# Altium project PCB_Project.PrjPcb
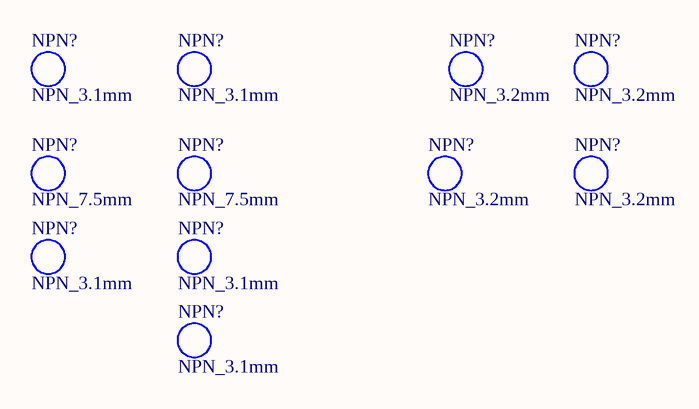
[diagram p0: snr-0005_panel.SchDoc]
1 sheet, 11 parts. Net scope: global (net labels, ports and power ports of the same name join across sheets).
Board file: snr-0007.PcbDoc

## Sheet snr-0005_panel.SchDoc
size A4; SheetNumber: 1; SheetTotal: 1

### Parts
NPN1  NPN_3.1mm  [HOLE_NPH_3.1_LED_3mm]
NPN2  NPN_3.1mm  [HOLE_NPH_3.1_LED_3mm]
NPN3  NPN_3.2mm  [HOLE_NPH_3.2_M3]
NPN4  NPN_3.2mm  [HOLE_NPH_3.2_M3]
NPN5  NPN_7.5mm  [HOLE_NPH_7.5_F01]
NPN6  NPN_7.5mm  [HOLE_NPH_7.5_F01]
NPN7  NPN_3.2mm  [HOLE_NPH_3.2_M3]
NPN8  NPN_3.2mm  [HOLE_NPH_3.2_M3]
NPN10  NPN_3.1mm  [HOLE_NPH_3.1_LED_3mm]
NPN11  NPN_3.1mm  [HOLE_NPH_3.1_LED_3mm]
NPN?  NPN_3.1mm  [HOLE_NPH_3.1_LED_3mm]

### Library data of the parts
NPN1 NPN2 NPN10 NPN11 NPN? = NPH_3.1mm_LED_3mm
NPN3 NPN4 NPN7 NPN8 = NPH_3.2mm_M3
NPN5 NPN6 = NPH_7.5mm_F01